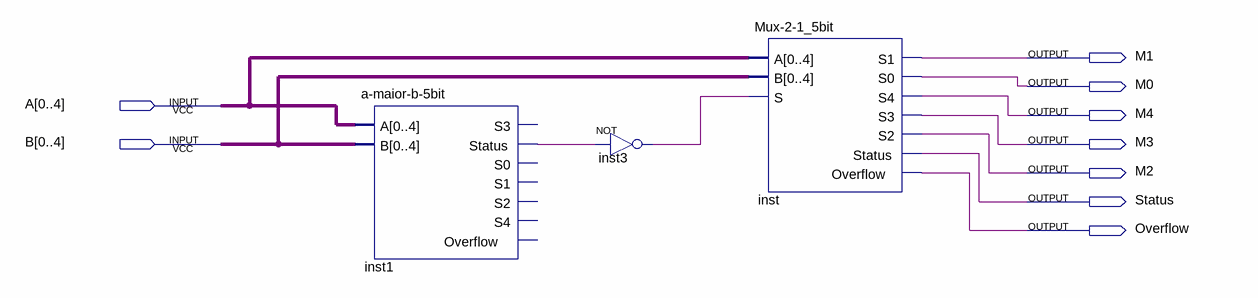
[diagram p0: schematic sheet]
// Quartus schematic max-a-b-5bit.bdf as structural Verilog: 3 symbols, 9 pins
module \max-a-b-5bit  (
  input  [0:4] A,
  input  [0:4] B,
  output M1,
  output M0,
  output M4,
  output M3,
  output M2,
  output Status,
  output Overflow
);

  wire inst1_status, inst3_out;

  \a-maior-b-5bit  inst1 (.A(A), .B(B), .Status(inst1_status));  // open: S3, S0, S1, S2, S4, Overflow
  not inst3 (inst3_out, inst1_status);
  \Mux-2-1_5bit  inst (
    .A(A), .B(B), .S(inst3_out), .S1(M1), .S0(M0), .S4(M4), .S3(M3), .S2(M2), .Status(Status),
    .Overflow(Overflow));
endmodule
